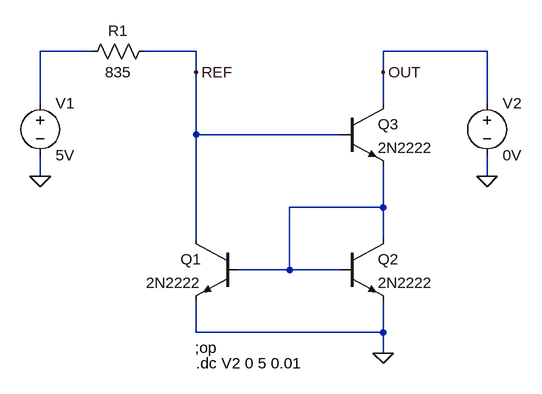
[diagram p0: schematic main.asc]
main.asc, the LTspice schematic file:
Version 4
SHEET 1 880 680
WIRE -96 -48 -176 -48
WIRE 64 -48 -16 -48
WIRE 512 -48 352 -48
WIRE 64 -16 64 -48
WIRE 352 -16 352 -48
WIRE -176 32 -176 -48
WIRE 352 32 352 -16
WIRE 512 32 512 -48
WIRE 64 80 64 -16
WIRE 288 80 64 80
WIRE -176 144 -176 112
WIRE 512 144 512 112
WIRE 352 192 352 128
WIRE 352 192 208 192
WIRE 64 240 64 80
WIRE 352 240 352 192
WIRE 208 288 208 192
WIRE 208 288 128 288
WIRE 288 288 208 288
WIRE 64 384 64 336
WIRE 352 384 352 336
WIRE 352 384 64 384
WIRE 352 416 352 384
FLAG 512 144 0
FLAG -176 144 0
FLAG 352 416 0
FLAG 352 -16 OUT
FLAG 64 -16 REF
SYMBOL npn 128 240 M0
SYMATTR InstName Q1
SYMATTR Value 2N2222
SYMBOL npn 288 240 R0
SYMATTR InstName Q2
SYMATTR Value 2N2222
SYMBOL npn 288 32 R0
SYMATTR InstName Q3
SYMATTR Value 2N2222
SYMBOL res 0 -64 R90
WINDOW 0 0 56 VBottom 2
WINDOW 3 32 56 VTop 2
SYMATTR InstName R1
SYMATTR Value 835
SYMBOL voltage 512 16 R0
SYMATTR InstName V2
SYMATTR Value 0V
SYMBOL voltage -176 16 R0
SYMATTR InstName V1
SYMATTR Value 5V
TEXT 62 408 Left 2 !;op
TEXT 64 432 Left 2 !.dc V2 0 5 0.01

The netlist it stands for:
* main.asc
Q1 REF N002 0 0 2N2222
Q2 N002 N002 0 0 2N2222
Q3 OUT REF N002 0 2N2222
R1 REF N001 835
V2 OUT 0 0V
V1 N001 0 5V
.model NPN NPN
.model PNP PNP
.lib standard.bjt
;op
.dc V2 0 5 0.01
.backanno
.end

* Results of the author's LTspice run, read from the files saved beside the schematic
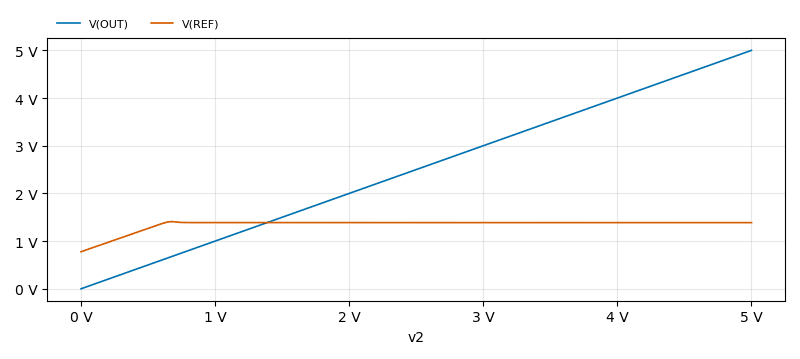
[diagram p1: DC transfer characteristic of main.asc, plotted from the saved traces]
* DC transfer characteristic, 1 run:
*   V(OUT): 0 V at v2=0 V, 5 V at v2=5 V, min 0 V, max 5 V
*   V(REF): 777.2 mV at v2=0 V, 1.387 V at v2=5 V, min 777.2 mV, max 1.408 V